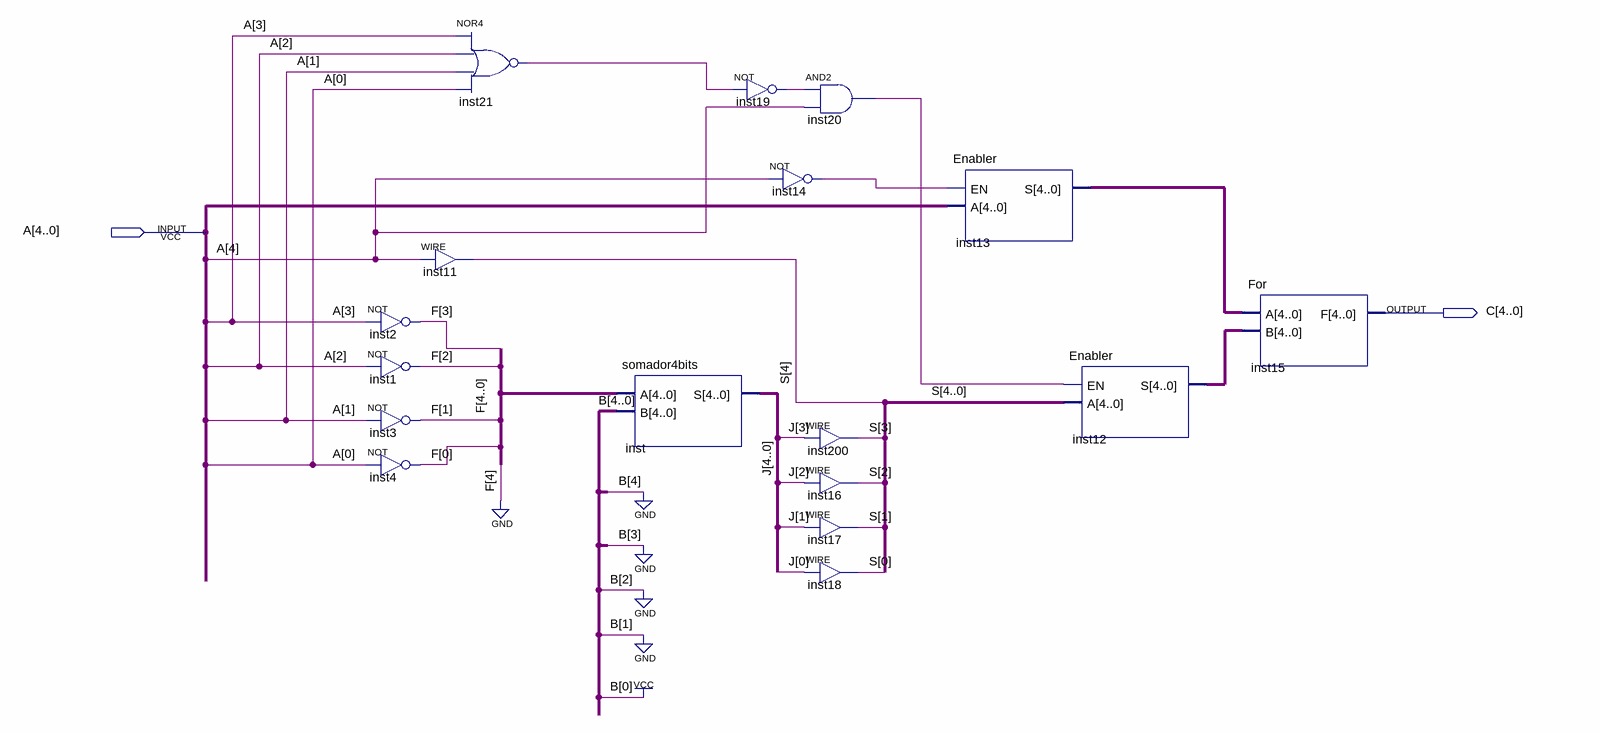
[diagram p0: schematic sheet]
// Quartus schematic Complementadores.bdf as structural Verilog: 17 symbols, 2 pins
module Complementadores (
  input  [4:0] A,
  output [4:0] C
);

  wire inst14_out, inst19_out, inst20_out, inst21_out;
  wire [3:0] F;
  wire [4:0] inst12_s, inst13_s, J, S;

  not inst2 (F[3], A[3]);
  not inst1 (F[2], A[2]);
  not inst3 (F[1], A[1]);
  not inst4 (F[0], A[0]);
  nor inst21 (inst21_out, A[3], A[2], A[1], A[0]);
  assign S[4] = A[4];  // WIRE inst11
  somador4bits inst (.A({1'b0, F}), .B(5'b00001), .S(J));
  not inst19 (inst19_out, inst21_out);
  not inst14 (inst14_out, A[4]);
  and inst20 (inst20_out, inst19_out, A[4]);
  assign S[3] = J[3];  // WIRE inst200
  assign S[2] = J[2];  // WIRE inst16
  assign S[1] = J[1];  // WIRE inst17
  assign S[0] = J[0];  // WIRE inst18
  Enabler inst13 (.EN(inst14_out), .A(A), .S(inst13_s));
  Enabler inst12 (.EN(inst20_out), .A(S), .S(inst12_s));
  For inst15 (.A(inst13_s), .B(inst12_s), .F(C));
endmodule
